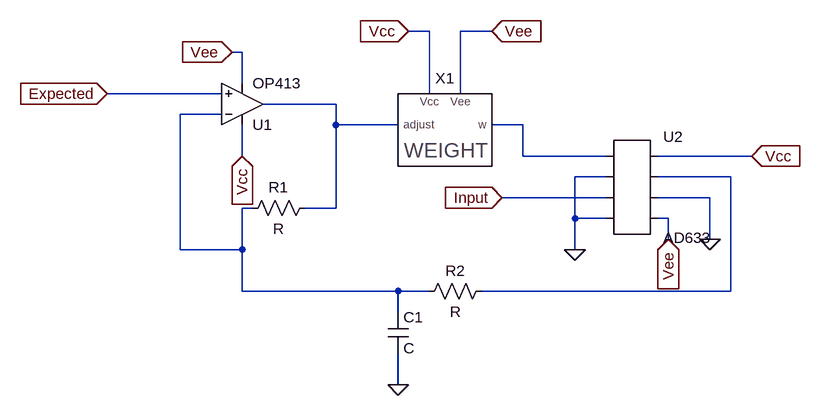
[diagram p0: schematic Draft1.asc]
Draft1.asc, the LTspice schematic file:
Version 4
SHEET 1 900 680
WIRE 176 16 144 16
WIRE 272 16 224 16
WIRE -112 48 -128 48
WIRE -112 96 -112 48
WIRE -144 112 -320 112
WIRE 176 112 176 16
WIRE 224 112 224 16
WIRE 32 128 -80 128
WIRE -144 144 -208 144
WIRE 32 160 32 128
WIRE 128 160 32 160
WIRE 320 160 272 160
WIRE -112 208 -112 160
WIRE 320 208 320 160
WIRE 448 208 320 208
WIRE 672 208 528 208
WIRE 448 240 400 240
WIRE 640 240 528 240
WIRE 448 272 288 272
WIRE 608 272 528 272
WIRE -96 288 -112 288
WIRE 32 288 32 160
WIRE 32 288 -16 288
WIRE 400 304 400 240
WIRE 448 304 400 304
WIRE 544 304 528 304
WIRE 544 336 544 304
WIRE 608 336 608 272
WIRE -208 352 -208 144
WIRE -112 352 -112 288
WIRE -112 352 -208 352
WIRE 400 352 400 304
WIRE -112 416 -112 352
WIRE 128 416 -112 416
WIRE 176 416 128 416
WIRE 640 416 640 240
WIRE 640 416 256 416
WIRE 128 448 128 416
WIRE 128 560 128 512
FLAG 400 352 0
FLAG 288 272 Input
IOPIN 288 272 In
FLAG 128 560 0
FLAG 608 336 0
FLAG -112 208 Vcc
IOPIN -112 208 In
FLAG 144 16 Vcc
IOPIN 144 16 In
FLAG 672 208 Vcc
IOPIN 672 208 In
FLAG -128 48 Vee
IOPIN -128 48 In
FLAG 272 16 Vee
IOPIN 272 16 In
FLAG 544 336 Vee
IOPIN 544 336 In
FLAG -320 112 Expected
IOPIN -320 112 In
SYMBOL Weight 192 160 R0
SYMATTR InstName X1
SYMBOL OpAmps\\OP413 -112 192 M180
SYMATTR InstName U1
SYMBOL AutoGenerated\\AD633 480 256 R0
SYMATTR InstName U2
SYMBOL res 0 272 R90
WINDOW 0 0 56 VBottom 2
WINDOW 3 32 56 VTop 2
SYMATTR InstName R1
SYMBOL res 272 400 R90
WINDOW 0 0 56 VBottom 2
WINDOW 3 32 56 VTop 2
SYMATTR InstName R2
SYMBOL cap 112 448 R0
SYMATTR InstName C1

The netlist it stands for:
* Draft1.asc
XX1 N001 Vcc Vee N003 Weight  ; pins adjust Vcc Vee w
XU1 Expected N002 Vcc Vee N001 OP413  ; pins In+ In- V+ V- OUT
* U2: AD633 (symbol AutoGenerated\AD633 not available, pins judged from their places): pin1=N003 pin2=0 pin3=Input pin4=0 pin5=Vcc pin6=N004 pin7=0 pin8=Vee
R1 N001 N002 R
R2 N004 N002 R
C1 N002 0 C
.backanno
.end